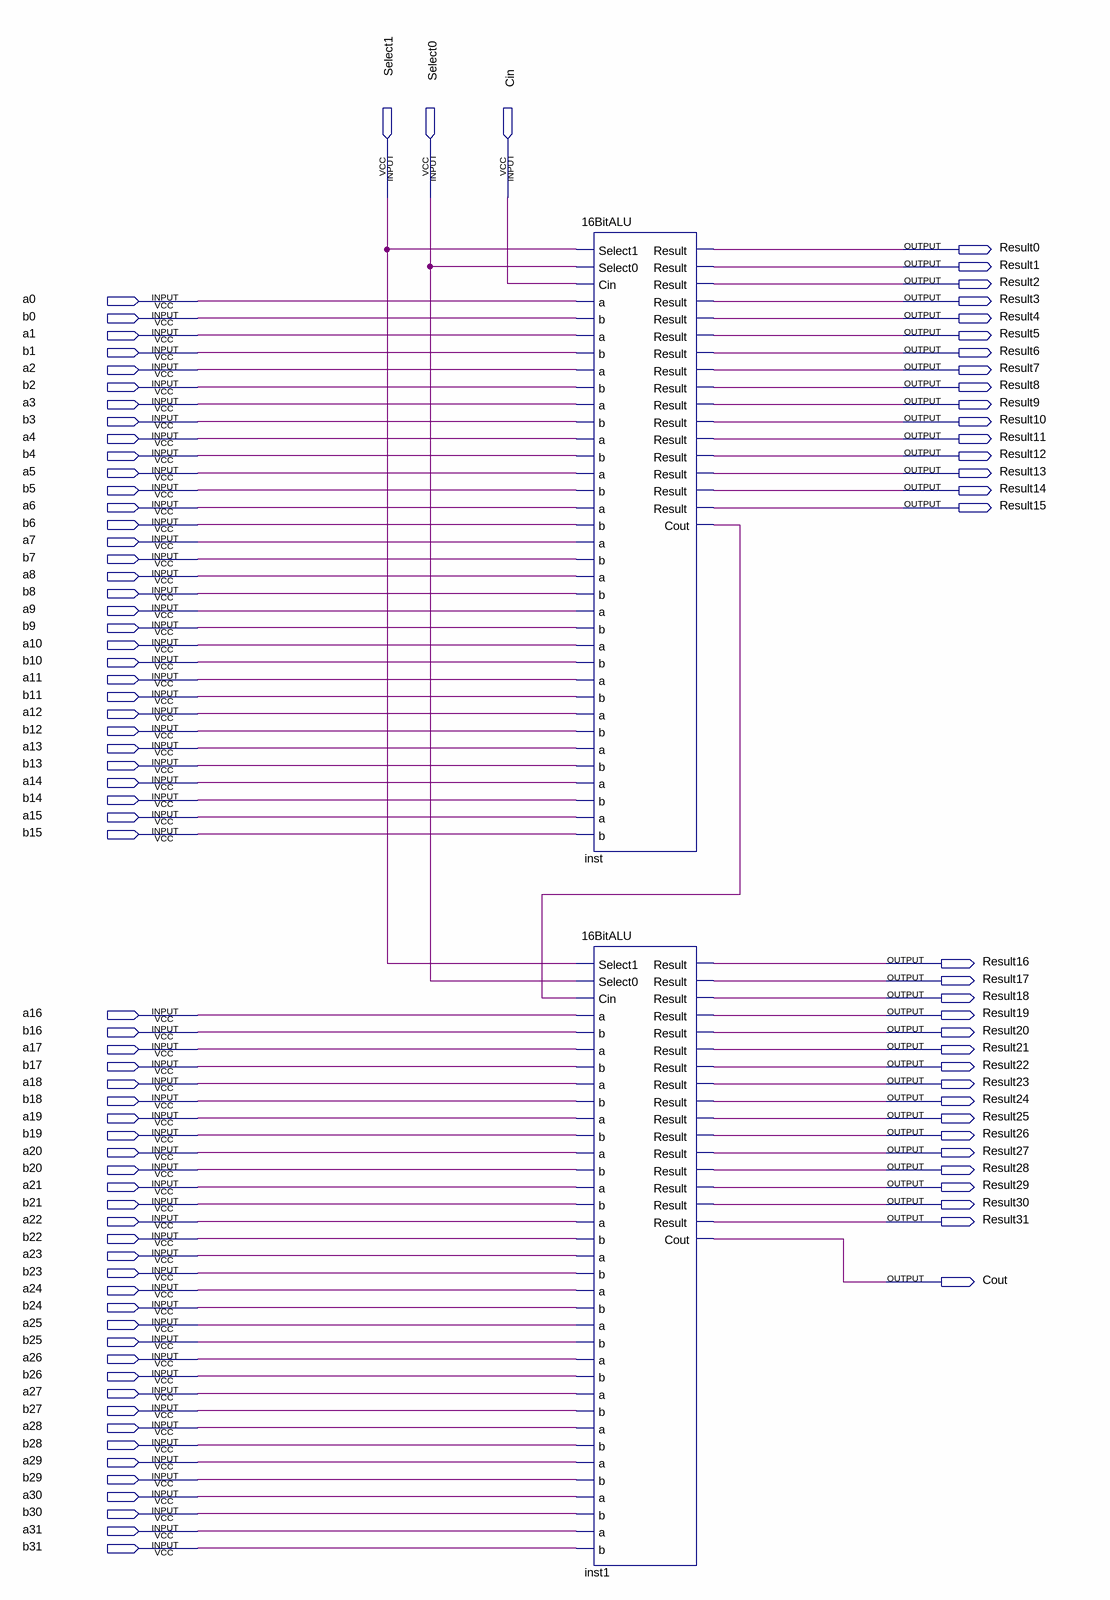
[diagram p0: schematic sheet]
// Quartus schematic 32BitALU.bdf as structural Verilog: 2 symbols, 100 pins
module \32BitALU  (
  input  Select1,
  input  Select0,
  input  Cin,
  input  a0,
  input  b0,
  input  a1,
  input  b1,
  input  a2,
  input  b2,
  input  a3,
  input  b3,
  input  a4,
  input  b4,
  input  a5,
  input  b5,
  input  a6,
  input  b6,
  input  a7,
  input  b7,
  input  a8,
  input  b8,
  input  a9,
  input  b9,
  input  a10,
  input  b10,
  input  a11,
  input  b11,
  input  a12,
  input  b12,
  input  a13,
  input  b13,
  input  a14,
  input  b14,
  input  a15,
  input  b15,
  input  a16,
  input  b16,
  input  a17,
  input  b17,
  input  a18,
  input  b18,
  input  a19,
  input  b19,
  input  a20,
  input  b20,
  input  a21,
  input  b21,
  input  a22,
  input  b22,
  input  a23,
  input  b23,
  input  a24,
  input  b24,
  input  a25,
  input  b25,
  input  a26,
  input  b26,
  input  a27,
  input  b27,
  input  a28,
  input  b28,
  input  a29,
  input  b29,
  input  a30,
  input  b30,
  input  a31,
  input  b31,
  output Result0,
  output Result1,
  output Result2,
  output Result3,
  output Result4,
  output Result5,
  output Result6,
  output Result7,
  output Result8,
  output Result9,
  output Result10,
  output Result11,
  output Result12,
  output Result13,
  output Result14,
  output Result15,
  output Result16,
  output Result17,
  output Result18,
  output Result19,
  output Result20,
  output Result21,
  output Result22,
  output Result23,
  output Result24,
  output Result25,
  output Result26,
  output Result27,
  output Result28,
  output Result29,
  output Result30,
  output Result31,
  output Cout
);

  wire inst_cout;

  \16BitALU  inst (
    .Select1(Select1), .Select0(Select0), .Cin(Cin),
    .a({a0, a1, a2, a3, a4, a5, a6, a7, a8, a9, a10, a11, a12, a13, a14, a15}),
    .b({b0, b1, b2, b3, b4, b5, b6, b7, b8, b9, b10, b11, b12, b13, b14, b15}),
    .Result({Result0, Result1, Result2, Result3, Result4, Result5, Result6, Result7, Result8, Result9, Result10, Result11, Result12, Result13, Result14, Result15}),
    .Cout(inst_cout));
  \16BitALU  inst1 (
    .Select1(Select1), .Select0(Select0), .Cin(inst_cout),
    .a({a16, a17, a18, a19, a20, a21, a22, a23, a24, a25, a26, a27, a28, a29, a30, a31}),
    .b({b16, b17, b18, b19, b20, b21, b22, b23, b24, b25, b26, b27, b28, b29, b30, b31}),
    .Result({Result16, Result17, Result18, Result19, Result20, Result21, Result22, Result23, Result24, Result25, Result26, Result27, Result28, Result29, Result30, Result31}),
    .Cout(Cout));
endmodule
